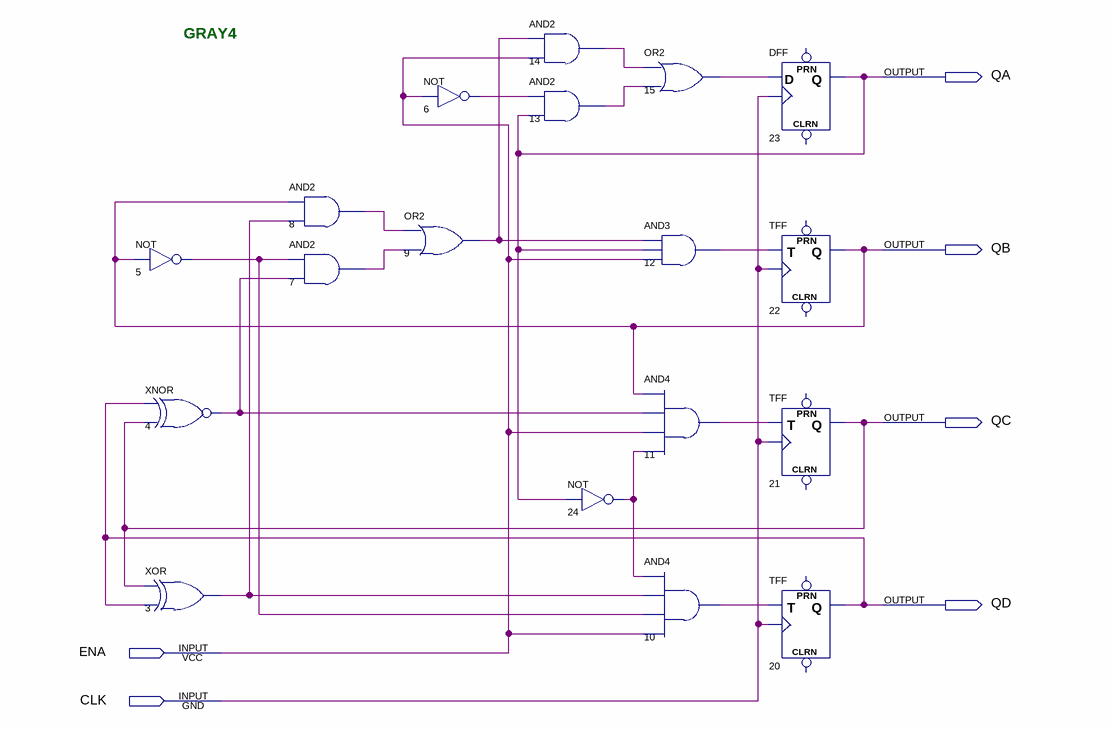
[diagram p0: schematic sheet]
// Quartus schematic pgray4.bdf as structural Verilog: 18 symbols, 6 pins
module pgray4 (
  input  ENA,
  input  CLK,
  output QA,
  output QB,
  output QC,
  output QD
);

  wire n3_out, n4_out, n5_out, n6_out, n7_out, n8_out, n9_out, n10_out, n11_out, n12_out, n13_out, n14_out,
       n15_out, n24_out;

  not u_5 (n5_out, QB);
  xnor u_4 (n4_out, QD, QC);
  xor u_3 (n3_out, QC, QD);
  and u_8 (n8_out, QB, n3_out);
  and u_7 (n7_out, n5_out, n4_out);
  not u_6 (n6_out, ENA);
  or u_9 (n9_out, n8_out, n7_out);
  and u_14 (n14_out, n9_out, ENA);
  and u_13 (n13_out, n6_out, QA);
  not u_24 (n24_out, QA);
  or u_15 (n15_out, n14_out, n13_out);
  and u_12 (n12_out, n9_out, QA, ENA);
  and u_11 (n11_out, QB, n4_out, ENA, n24_out);
  and u_10 (n10_out, n24_out, n3_out, n5_out, ENA);
  DFF u_23 (.CLK(CLK), .D(n15_out), .Q(QA));  // open: CLRN, PRN
  TFF u_22 (.T(n12_out), .CLK(CLK), .Q(QB));  // open: PRN, CLRN
  TFF u_21 (.T(n11_out), .CLK(CLK), .Q(QC));  // open: PRN, CLRN
  TFF u_20 (.T(n10_out), .CLK(CLK), .Q(QD));  // open: PRN, CLRN

  // Notes on the sheet:
  //   GRAY4
endmodule
